# Altium schematic sheet PhaseShifter.SchDoc: Top Level
size 431 x 279 mm; Author: Kevin Heyer; DrawnBy: Kevin Heyer; Organization: ORGANIZATION; Address1: 207; Address2: 13399 104 Ave; Address3: Surrey BC, V3T 0C9; Address4: Canada; Revision: V0.0.0; SheetNumber: 1; SheetTotal: 2; Project: IQ Demod; ENG_APP_DATE: --/--/--; DSN_APP_DATE: --/--/--; CHK_APP_DATE: --/--/--
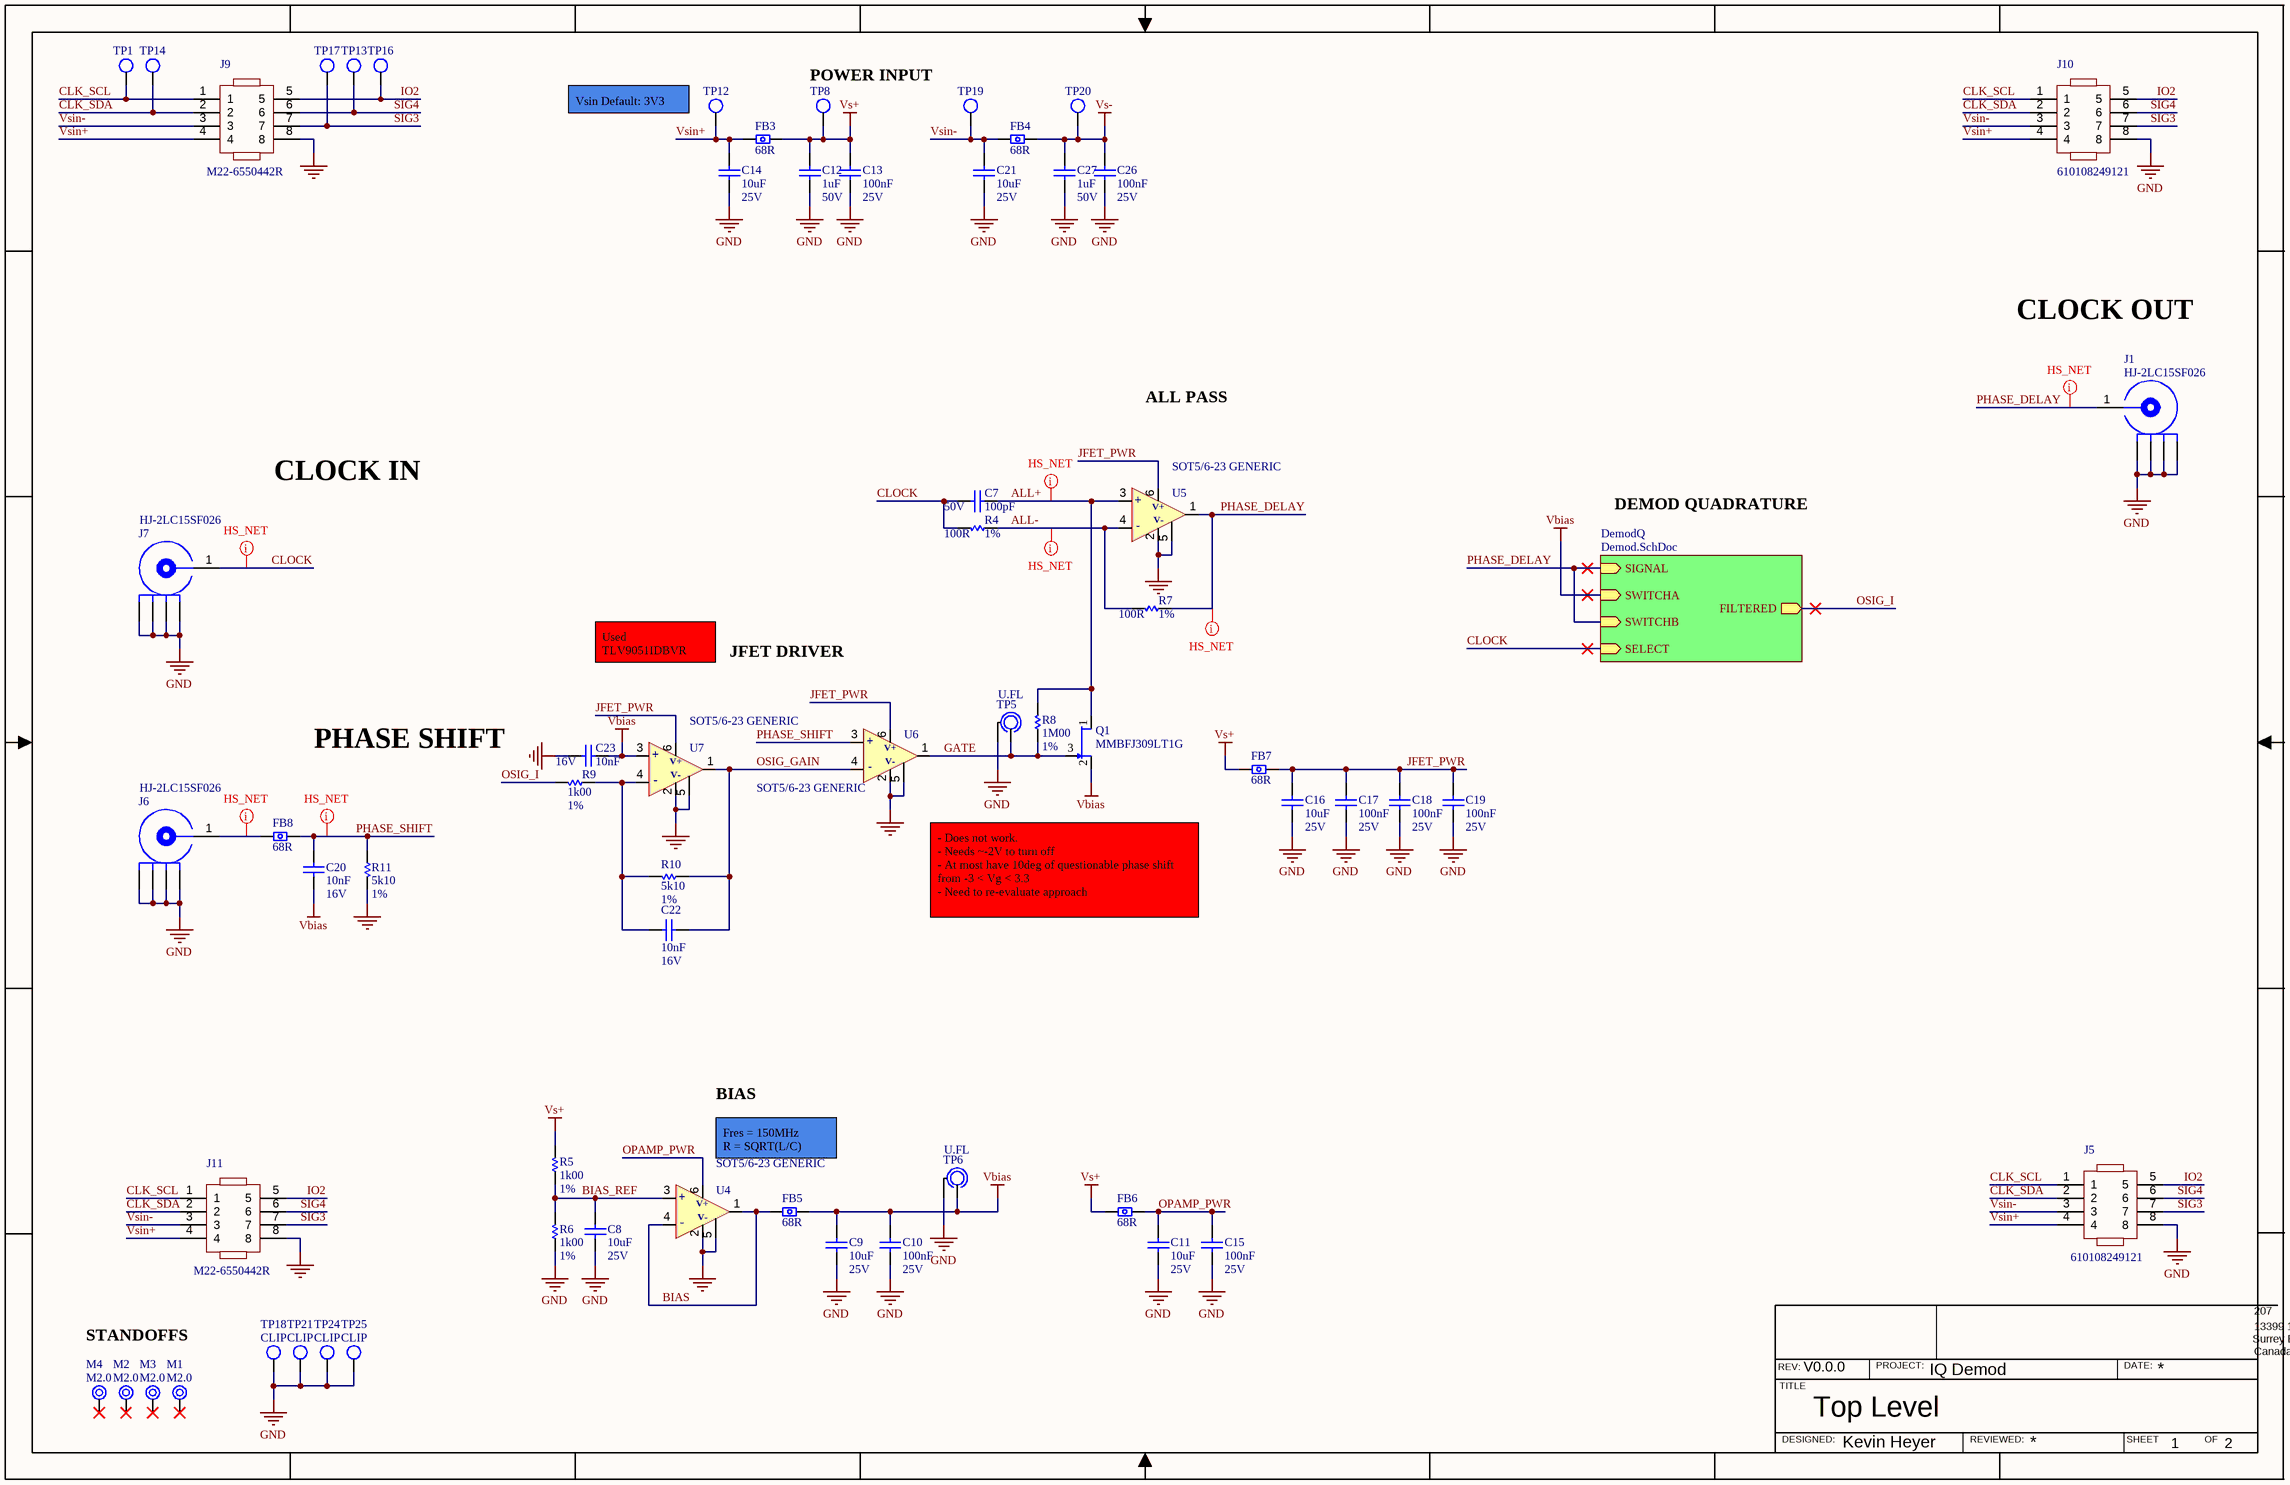
[diagram p0: PhaseShifter.SchDoc]

## Parts
C7  100pF  Voltage Rating (DC): 50V  [C0402]
C8  10uF  Voltage Rating: 25V  [c0805]
C9  10uF  Voltage Rating: 25V  [c0805]
C10  100nF  Voltage Rating: 25V  [C0402]
C11  10uF  Voltage Rating: 25V  [c0805]
C12  1uF  Voltage Rating: 50V  [c0603]
C13  100nF  Voltage Rating: 25V  [C0402]
C14  10uF  Voltage Rating: 25V  [c0805]
C15  100nF  Voltage Rating: 25V  [C0402]
C16  10uF  Voltage Rating: 25V  [c0805]
C17  100nF  Voltage Rating: 25V  [C0402]
C18  100nF  Voltage Rating: 25V  [C0402]
C19  100nF  Voltage Rating: 25V  [C0402]
C20  10nF  Voltage Rating: 16V  [c0402]
C21  10uF  Voltage Rating: 25V  [c0805]
C22  10nF  Voltage Rating: 16V  [c0402]
C23  10nF  Voltage Rating: 16V  [c0402]
C26  100nF  Voltage Rating: 25V  [C0402]
C27  1uF  Voltage Rating: 50V  [c0603]
FB3  68R  [FB0402]
FB4  68R  [FB0402]
FB5  68R  [FB0402]
FB6  68R  [FB0402]
FB7  68R  [FB0402]
FB8  68R  [FB0402]
J1  HJ-2LC15SF026  [SMA TH BORE]
J5  610108249121  [CONN HDR 08 MALE RA 2ROW - duplicate]
J6  HJ-2LC15SF026  [SMA TH BORE]
J7  HJ-2LC15SF026  [SMA TH BORE]
J9  M22-6550442R  [CONN HDR 08 FEMALE RA 2ROW]
J10  610108249121  [CONN HDR 08 MALE RA 2ROW - duplicate]
J11  M22-6550442R  [CONN HDR 08 FEMALE RA 2ROW]
M1  M2.0  [MECH M2.0 UNPLATED]  (no BOM)
M2  M2.0  [MECH M2.0 UNPLATED]  (no BOM)
M3  M2.0  [MECH M2.0 UNPLATED]  (no BOM)
M4  M2.0  [MECH M2.0 UNPLATED]  (no BOM)
Q1  MMBFJ309LT1G  [SOT 23-3]
R4  100R  Tolerance: 1%  [R0402]
R5  1k00  Tolerance: 1%  [R0402]
R6  1k00  Tolerance: 1%  [R0402]
R7  100R  Tolerance: 1%  [R0402]
R8  1M00  Tolerance: 1%  [r0402]
R9  1k00  Tolerance: 1%  [R0402]
R10  5k10  Tolerance: 1%  [R0402]
R11  5k10  Tolerance: 1%  [R0402]
TP1  1mm  [TESTPOINT_SMT]  (value not drawn)  (no BOM)
TP5  U.FL  [U.FL]
TP6  U.FL  [U.FL]
TP8  1mm  [TESTPOINT_SMT]  (value not drawn)  (no BOM)
TP12  1mm  [TESTPOINT_SMT]  (value not drawn)  (no BOM)
TP13  1mm  [TESTPOINT_SMT]  (value not drawn)  (no BOM)
TP14  1mm  [TESTPOINT_SMT]  (value not drawn)  (no BOM)
TP16  1mm  [TESTPOINT_SMT]  (value not drawn)  (no BOM)
TP17  1mm  [TESTPOINT_SMT]  (value not drawn)  (no BOM)
TP18  CLIP  [TESTPOINT_CLIP_1206]
TP19  1mm  [TESTPOINT_SMT]  (value not drawn)  (no BOM)
TP20  1mm  [TESTPOINT_SMT]  (value not drawn)  (no BOM)
TP21  CLIP  [TESTPOINT_CLIP_1206]
TP24  CLIP  [TESTPOINT_CLIP_1206]
TP25  CLIP  [TESTPOINT_CLIP_1206]
U4  SOT5/6-23 GENERIC  [SOT23-5/6_Modified]
U5  SOT5/6-23 GENERIC  [SOT23-5/6_Modified]
U6  SOT5/6-23 GENERIC  [SOT23-5/6_Modified]
U7  SOT5/6-23 GENERIC  [SOT23-5/6_Modified]

## Sub-sheets
DemodQ = Demod.SchDoc: SIGNAL (in), SWITCHA (in), SWITCHB (in), FILTERED (out), SELECT (in)

## Nets
GND: C8.1 C9.1 C10.2 C11.1 C12.1 C13.1 C14.1 C15.2 C16.1 C17.2 C18.2 C19.2 C21.1 C23.1 C26.1 C27.1 J1.0 J5.8 J6.0 J7.0 J9.8 J10.8 J11.8 R6.1 R11.2 TP5.0 TP6.0 TP18.1 TP21.1 TP24.1 TP25.1 U4.2(V-) U4.5 U5.2(V-) U5.5 U6.2(V-) U6.5 U7.2(V-) U7.5
Vbias: C9.2 C10.1 C20.2 C23.2 FB5.1 Q1.2(S) TP6.1 U7.3(+) ; sheet DemodQ/SWITCHA
Vs+: C12.2 C13.2 FB3.1 FB6.2 FB7.2 R5.2 TP8.1
Vs-: C26.2 C27.2 FB4.1 TP20.1
ALL+: C7.1 Q1.1(D) R8.2 U5.3(+)
ALL-: R4.1 R7.2 U5.4(-)
BIAS: FB5.2 U4.1 U4.4(-)
BIAS_REF: C8.2 R5.1 R6.2 U4.3(+)
CLK_SCL: J5.1 J9.1 J10.1 J11.1 TP1.1
CLK_SDA: J5.2 J9.2 J10.2 J11.2 TP14.1
CLOCK: C7.2 J7.1 R4.2 ; sheet DemodQ/SELECT
GATE: Q1.3(G) R8.1 TP5.1 U6.1
IO2: J5.5 J9.5 J10.5 J11.5 TP16.1
JFET_PWR: C16.2 C17.1 C18.1 C19.1 FB7.1 U5.6(V+) U6.6(V+) U7.6(V+)
OPAMP_PWR: C11.2 C15.1 FB6.1 U4.6(V+)
OSIG_GAIN: C22.1 R10.1 U6.4(-) U7.1
OSIG_I: R9.2 ; sheet DemodQ/FILTERED
PHASE_DELAY: J1.1 R7.1 U5.1 ; sheet DemodQ/SIGNAL, sheet DemodQ/SWITCHB
PHASE_SHIFT: C20.1 FB8.1 R11.1 U6.3(+)
SIG3: J5.7 J9.7 J10.7 J11.7 TP17.1
SIG4: J5.6 J9.6 J10.6 J11.6 TP13.1
Vsin+: C14.2 FB3.2 J5.4 J9.4 J10.4 J11.4 TP12.1
Vsin-: C21.2 FB4.2 J5.3 J9.3 J10.3 J11.3 TP19.1
NetC22_2: C22.2 R9.1 R10.2 U7.4(-)
NetFB8_2: FB8.2 J6.1

Not connected (* = marked no-connect by the designer): M1 1*; M2 1*; M3 1*; M4 1*

## Layout directives
net class HS_NET; rule Clearance Constraint [Generic clearance = 10mil, and 30 value(s) for objects]; rule Impedance Constraint [Min = 42.50    Max = 57.50    ]: ALL+, ALL-, CLOCK, NetFB8_2, PHASE_DELAY, PHASE_SHIFT

## Notes on the sheet
- (near TP8) POWER INPUT
- (near TP12) Vsin Default: 3V3
- CLOCK OUT
- ALL PASS
- CLOCK IN
- DEMOD QUADRATURE
- Used TLV9051IDBVR
- JFET DRIVER
- PHASE SHIFT
- - Does not work.
  - Needs ~-2V to turn off
  - At most have 10deg of questionable phase shift from -3 < Vg < 3.3
  - Need to re-evaluate approach
- BIAS
- Fres = 150MHz
  R = SQRT(L/C)
- STANDOFFS
- REV:
- PROJECT:
- DATE:
- TITLE
- SHEET
- OF
- DESIGNED:
- REVIEWED:

## Library data of the parts
C7 = CAP CER 100pF 50V C0G 0402: 0402 100 pF 50 V ±5% Tolerance NP0/C0G Multilayer Ceramic Chip Capacitor; Manufacturer: Yageo; Manufacturer Part Number: CC0402JPNPO9BN101; Dielectric: C0G; Supplier 1: Digi-Key; RoHS: Yes; Category: Ceramic Capacitors; Stock 1: 83787; Pricing 1: 1=0.10000, 10=0.01900, 50=0.01040, 100=0.00850, 500=0.00604, 1000=0.00475, 2500=0.00432, 5000=0.00397 (USD); Case/Package: 0402; Case Code (Imperial): 0402; Case Code (Metric): 1005; Weight: 2.3E-05oz; Min Operating Temperature: -55°C; Max Operating Temperature: 125°C; Tolerance: 5%; Packaging: Tape and Reel; Capacitance: 100pF; Termination: SMD/SMT; Resistor Type: Ceramic; Length: 1mm; Width: 0.5mm; Depth: 0.5mm; RoHS Compliant: Yes; ComponentLink1URL: http://www.mouser.com/ds/2/447/Yageo_UPY-GP_NP0_16V-to-50V_9-358835.pdf?src-supplier=Mouser; ComponentLink1Description: http://www.mouser.com/ds/2/447/Yageo_UPY-GP_NP0_16V-to-50V_9-358835.pdf?src-supplier=Mouser; ComponentLink2URL: http://components.arrow.com/part/dataview/0323_04038301?src-supplier=Arrow+Europe; ComponentLink2Description: http://components.arrow.com/part/dataview/0323_04038301?src-supplier=Arrow+Europe; Supplier Part Number 1: 13-CC0402JPNPO9BN101CT-ND
C8 C9 C11 C14 C16 C21 = CAP CER 10uF 25V X5R 0805: Cap Ceramic 10uF 25V X5R 10% SMD 0805 85°C Embossed T/R; Manufacturer: Samsung; Manufacturer Part Number: CL21A106KAYNNNE; Supplier 1: Digi-Key; RoHS: Yes; Category: Ceramic Capacitors; Stock 1: 2266338; Pricing 1: 2000=0.03549, 4000=0.03247 (USD); Mount: Surface Mount; Case/Package: 0805; Case Code (Metric): 2012; Case Code (Imperial): 0805; Min Operating Temperature: -55°C; Max Operating Temperature: 85°C; Package Quantity: 1; Packaging: Tape and Reel; Capacitance: 10uF; Tolerance: 10%; Dielectric: X5R; Series: CL; Construction: Flat; Length: 2mm; Width: 0.049inch; Height: 1.25mm; Depth: 1.25mm; Thickness: 0.057inch; Radiation Hardening: No; RoHS Compliant: Yes; ComponentLink1URL: https://datasheet.ciiva.com/25796/cl21a106kaynnne-25796720.pdf?src-supplier=Digi-Key; ComponentLink1Description: https://datasheet.ciiva.com/25796/cl21a106kaynnne-25796720.pdf?src-supplier=Digi-Key; ComponentLink2URL: https://datasheet.ciiva.com/26838/getdatasheetpartid-357558-26838583.pdf?src-supplier=Verical; ComponentLink2Description: https://datasheet.ciiva.com/26838/getdatasheetpartid-357558-26838583.pdf?src-supplier=Verical; Supplier Part Number 1: 1276-2891-2-ND
C10 C13 C15 C17-C19 C26 = CAP CER 100nF 25V X5R 0402: Cap Ceramic 0.1uF 25V X5R 10% Pad SMD 0402 85¡ãC T/R / Multi Layer Ceramic Capacitor (MLCC); Manufacturer: Samsung; Manufacturer Part Number: CL05A104KA5NNNC; Supplier 1: Digi-Key; RoHS: Yes; Category: Ceramic Capacitors; Stock 1: 8053194; Pricing 1: 1=0.10000, 10=0.01100, 50=0.00600, 100=0.00490, 500=0.00346, 1000=0.00272, 2500=0.00248, 5000=0.00228 (USD); Mount: Surface Mount; Case/Package: 0402; Case Code (Metric): 1005; Case Code (Imperial): 0402; Min Operating Temperature: -55°C; Max Operating Temperature: 85°C; Capacitance: 100nF; Tolerance: 10%; Dielectric: X5R; Packaging: Tape and Reel; Package Quantity: 1; Voltage: 25V; Series: CL; Construction: Flat; Voltage Rating (DC): 25V; Length: 1mm; Width: 0.02inch; Height: 0.5mm; Thickness: 0.022inch; Depth: 0.5mm; Radiation Hardening: No; Lead Free: Lead Free; ComponentLink1URL: https://datasheet.ciiva.com/25802/cl05a104ka5nnnc-25802704.pdf?src-supplier=Digi-Key; ComponentLink1Description: https://datasheet.ciiva.com/25802/cl05a104ka5nnnc-25802704.pdf?src-supplier=Digi-Key; ComponentLink2URL: https://datasheet.ciiva.com/26838/getdatasheetpartid-357412-26838142.pdf?src-supplier=Verical; ComponentLink2Description: https://datasheet.ciiva.com/26838/getdatasheetpartid-357412-26838142.pdf?src-supplier=Verical; ComponentLink3URL: https://datasheet.ciiva.com/16437/cl05a104ka5nnnc-16437369.pdf?src-supplier=Future+Electronics; ComponentLink3Description: https://datasheet.ciiva.com/16437/cl05a104ka5nnnc-16437369.pdf?src-supplier=Future+Electronics; ComponentLink4URL: https://datasheet.ciiva.com/26309/mlcc-catalogdownload2013-eng-26309014.pdf?src-supplier=Distrelec; ComponentLink4Description: https://datasheet.ciiva.com/26309/mlcc-catalogdownload2013-eng-26309014.pdf?src-supplier=Distrelec; Supplier Part Number 1: 1276-1043-1-ND
C12 C27 = CAP CER 1uF 50V X5R 0603: Multilayer Ceramic Capacitors (High dielectric type), 50V, 1 uF, ± 10 %, 0603, X5R, RoHS; Manufacturer: Taiyo Yuden; Manufacturer Part Number: UMK107BJ105KA-T; Tolerance: 10%; Supplier 1: Digi-Key; RoHS: Yes; Category: Ceramic Capacitors; Stock 1: 955108; Pricing 1: 1=0.19000, 10=0.12900, 50=0.07760, 100=0.06560, 500=0.04484, 1000=0.03968 (USD); Mount: Surface Mount; Case/Package: 0603; Number of Pins: 2; Case Code (Metric): 1608; Case Code (Imperial): 0603; Contact Plating: Nickel; Min Operating Temperature: -55°C; Max Operating Temperature: 85°C; Capacitance: 1uF; Packaging: Tape and Reel; Package Quantity: 1; Dielectric: X5R; Voltage Rating (DC): 50V; Termination: SMD/SMT; Series: M; Construction: Flat; Length: 1.6mm; Width: 0.031inch; Height: 0.8mm; Depth: 0.8mm; Thickness: 0.035inch; Radiation Hardening: No; RoHS Compliant: Yes; REACH SVHC: Unknown; Halogen Free: Halogen Free; ComponentLink1URL: https://datasheet.ciiva.com/134/umk107bj105ka-t-ss-134740.pdf?src-supplier=Digi-Key; ComponentLink1Description: https://datasheet.ciiva.com/134/umk107bj105ka-t-ss-134740.pdf?src-supplier=Digi-Key; ComponentLink2URL: https://datasheet.ciiva.com/11601/umk107bj105ka-t-ss-11601811.pdf?src-supplier=Avnet; ComponentLink2Description: https://datasheet.ciiva.com/11601/umk107bj105ka-t-ss-11601811.pdf?src-supplier=Avnet; ComponentLink3URL: https://datasheet.ciiva.com/5744/1697715-5744913.pdf?src-supplier=Farnell; ComponentLink3Description: https://datasheet.ciiva.com/5744/1697715-5744913.pdf?src-supplier=Farnell; ComponentLink4URL: https://datasheet.ciiva.com/30199/43umk107bj105ka-t-30199791.pdf?src-supplier=Onlinecomponents.com; ComponentLink4Description: https://datasheet.ciiva.com/30199/43umk107bj105ka-t-30199791.pdf?src-supplier=Onlinecomponents.com; ComponentLink5URL: https://datasheet.ciiva.com/15922/336umk107bj105ka-t-15922611.pdf?src-supplier=Onlinecomponents.com; ComponentLink5Description: https://datasheet.ciiva.com/15922/336umk107bj105ka-t-15922611.pdf?src-supplier=Onlinecomponents.com; ComponentLink6URL: https://datasheet.ciiva.com/5427/mlcc-all-e-541559-5427036.pdf?src-supplier=Mouser; ComponentLink6Description: https://datasheet.ciiva.com/5427/mlcc-all-e-541559-5427036.pdf?src-supplier=Mouser; ComponentLink7URL: https://datasheet.ciiva.com/7975/mlcc-all-e-7975898.pdf?src-supplier=Element14; ComponentLink7Description: https://datasheet.ciiva.com/7975/mlcc-all-e-7975898.pdf?src-supplier=Element14; ComponentLink8URL: https://datasheet.ciiva.com/7975/1697715-7975608.pdf?src-supplier=Element14; ComponentLink8Description: https://datasheet.ciiva.com/7975/1697715-7975608.pdf?src-supplier=Element14; ComponentLink9URL: https://datasheet.ciiva.com/22694/1697715-22694278.pdf?src-supplier=Element14; ComponentLink9Description: https://datasheet.ciiva.com/22694/1697715-22694278.pdf?src-supplier=Element14; Supplier Part Number 1: 587-2400-1-ND
C20 C22 C23 = CAP CER 10nF 16V Y5V 0402: 0402 10 nF 16 V -20 / +80 % Tolerance Y5V SMT Multilayer Ceramic Capacitor; Manufacturer: Yageo; Manufacturer Part Number: CC0402ZRY5V7BB103; Tolerance: 80%; Insulation Resistance: 100GR; Supplier 1: Future Electronics; RoHS: Yes; Category: Ceramic Capacitors; Stock 1: 10000; Pricing 1: 10000=0.00340, 30000=0.00320, 100000=0.00300, 200000=0.00290, 400000=0.00270 (USD); Mount: Surface Mount; Case/Package: 0402; Number of Pins: 2; Case Code (Imperial): 0402; Case Code (Metric): 1005; Dielectric Material: Ceramic; Min Operating Temperature: -55°C; Max Operating Temperature: 85°C; Capacitance: 10nF; Packaging: Tape and Reel; Voltage Rating (DC): 16V; Dielectric: Y5V; Termination: SMD/SMT; Series: CC; Package Quantity: 10000; Construction: Flat; Length: 1mm; Width: 0.02inch; Height: 0.5mm; Depth: 0.5mm; Thickness: 0.022inch; Terminal Length: 0.225mm; Radiation Hardening: No; RoHS Compliant: Yes; Lead Free: Lead Free; REACH SVHC: No SVHC; Halogen Free: Halogen Free; ComponentLink1URL: https://datasheet.ciiva.com/144/mlccorderingcode-144484.pdf?src-supplier=Digi-Key; ComponentLink1Description: https://datasheet.ciiva.com/144/mlccorderingcode-144484.pdf?src-supplier=Digi-Key; ComponentLink2URL: https://datasheet.ciiva.com/144/mlccorderingcode-144485.pdf?src-supplier=Digi-Key; ComponentLink2Description: https://datasheet.ciiva.com/144/mlccorderingcode-144485.pdf?src-supplier=Digi-Key; ComponentLink3URL: https://datasheet.ciiva.com/144/mlccorderingcode-144486.pdf?src-supplier=Digi-Key; ComponentLink3Description: https://datasheet.ciiva.com/144/mlccorderingcode-144486.pdf?src-supplier=Digi-Key; ComponentLink4URL: https://datasheet.ciiva.com/11586/upy-gphc-y5v-6-3v-to-50v-5-11586517.pdf?src-supplier=Avnet; ComponentLink4Description: https://datasheet.ciiva.com/11586/upy-gphc-y5v-6-3v-to-50v-5-11586517.pdf?src-supplier=Avnet; ComponentLink5URL: https://datasheet.ciiva.com/5789/1132289-5789565.pdf?src-supplier=Farnell; ComponentLink5Description: https://datasheet.ciiva.com/5789/1132289-5789565.pdf?src-supplier=Farnell; ComponentLink6URL: https://datasheet.ciiva.com/5789/1132289-5789566.pdf?src-supplier=Farnell; ComponentLink6Description: https://datasheet.ciiva.com/5789/1132289-5789566.pdf?src-supplier=Farnell; ComponentLink7URL: https://datasheet.ciiva.com/17437/upy-gphc-y5v-6-3v-to-50v-5-17437221.pdf?src-supplier=Avnet+Europe; ComponentLink7Description: https://datasheet.ciiva.com/17437/upy-gphc-y5v-6-3v-to-50v-5-17437221.pdf?src-supplier=Avnet+Europe; ComponentLink8URL: https://datasheet.ciiva.com/8033/1132289-8033641.pdf?src-supplier=Element14; ComponentLink8Description: https://datasheet.ciiva.com/8033/1132289-8033641.pdf?src-supplier=Element14; ComponentLink9URL: https://datasheet.ciiva.com/8033/1132289-8033642.pdf?src-supplier=Element14; ComponentLink9Description: https://datasheet.ciiva.com/8033/1132289-8033642.pdf?src-supplier=Element14; Supplier Part Number 1: 1300987
FB3-FB8 = FB 68R 400mA 310mR 0402: Ferrite Beads Multi-Layer 68Ohm 25% 100MHz 400mA 310mOhm DCR 0402 T/R; Manufacturer: Taiyo Yuden; Manufacturer Part Number: BK1005LL680-T; DC Resistance (DCR): 310mR; Number of Lines: 1; Shielding: Unshielded; Supplier 1: Digi-Key; RoHS: Yes; Category: Ferrite Beads and Chips; Stock 1: 9707; Pricing 1: 1=0.10000, 10=0.04100, 25=0.03640, 50=0.03300, 100=0.02970, 250=0.02176, 500=0.01584, 1000=0.01551, 5000=0.01056 (USD); Mount: Surface Mount; Case/Package: 0402; Number of Pins: 2; Case Code (Metric): 1005; Case Code (Imperial): 0402; Core Material: Ferrite; Min Operating Temperature: -55°C; Max Operating Temperature: 125°C; Packaging: Tape and Reel; Package Quantity: 1; Impedance: 68R; Tolerance: 25%; Max DC Current: 400mA; Termination: SMD/SMT; Test Frequency: 100MHz; Max Current Rating: 400mA; Series: BK; Frequency: 100MHz; Length: 0.039inch; Width: 0.02inch; Height: 0.022inch; Depth: 0.55mm; Halogen Free: Halogen Free; Lead Free: Lead Free; REACH SVHC: Unknown; ComponentLink1URL: https://datasheet.ciiva.com/1013/bk1005ll680-t-ss-1013936.pdf?src-supplier=Digi-Key; ComponentLink1Description: https://datasheet.ciiva.com/1013/bk1005ll680-t-ss-1013936.pdf?src-supplier=Digi-Key; ComponentLink2URL: https://datasheet.ciiva.com/1013/mlci07-e-1013935.pdf?src-supplier=Digi-Key; ComponentLink2Description: https://datasheet.ciiva.com/1013/mlci07-e-1013935.pdf?src-supplier=Digi-Key; ComponentLink3URL: https://datasheet.ciiva.com/1013/mlci07-e-1013937.pdf?src-supplier=Digi-Key; ComponentLink3Description: https://datasheet.ciiva.com/1013/mlci07-e-1013937.pdf?src-supplier=Digi-Key; Supplier Part Number 1: 587-1860-1-ND
J1 J6 J7 = CON SMA BORE TH HJ-SMA058
J5 J10 = CONN HDR 08 MALE RA 2 ROW: SMT Angled Pin Header WR-PHD, Pitch 2.54 mm, Dual Row, 8 pins; Manufacturer: Wurth Electronics; Number of Positions: 8; Current Rating: 3A; Gender: Male; Voltage Rating: 250V; Pitch: 0.1inch; Supplier 1: Newark; Manufacturer Part Number: 610108249121; RoHS: Yes; Category: Connectors; Stock 1: 350; Pricing 1: 1=1.53000, 10=1.52000, 25=1.49000, 50=1.46000, 100=1.36000 (USD); Mount: Surface Mount; Contact Plating: Gold; Contact Material: Copper Alloy; Insulation Color: Black; Insulation Material: Nylon; Contact Shape: Square; Connector Type: Header; Fastening Type: Pull; Packaging: Cut Tape; Number of Rows: 2; Termination: Solder; Flammability Rating: UL94 V-0; RoHS Compliant: Yes; ComponentLink1URL: http://www.farnell.com/cad/1889791.pdf?src-supplier=Element14; ComponentLink1Description: http://www.farnell.com/cad/1889791.pdf?src-supplier=Element14; Supplier Part Number 1: 72Y1215; Number of Pins: 8; Color: Black; Contact Finish - Mating: GOLD; Number of Contacts: 8; Series: WR-PHD; Contact Type: Male Pin; Row Spacing: 0.1inch; Contact Mating Length: 0.236inch; ComponentLink2URL: https://katalog.we-online.de/em/datasheet/6101xx249121.pdf?src-supplier=Digi-Key; ComponentLink2Description: https://katalog.we-online.de/em/datasheet/6101xx249121.pdf?src-supplier=Digi-Key; ComponentLink3URL: https://www.distrelec.bizhttp://katalog.we-online.de/em/datasheet/6101xx249121.pdf?mime=application%2Fpdf&src-supplier=Distrelec; ComponentLink3Description: https://www.distrelec.bizhttp://katalog.we-online.de/em/datasheet/6101xx249121.pdf?mime=application%2Fpdf&src-supplier=Distrelec
J9 J11 = CONN HDR 08 FEMALE RA 2 ROW: Conn Socket Strip RCP 8 POS 2mm Solder RA SMD T/R; Manufacturer: Harwin; Current Rating: 2A; Number of Positions: 8; Connector Type: Receptacle,Forked; Supplier 1: Newark; Manufacturer Part Number: M22-6550442R; RoHS: Yes; Category: Connectors; Stock 1: 750; Pricing 1: 1=1.17000, 100=0.91900, 250=0.84000, 500=0.76600, 1000=0.71200 (USD); Mount: Surface Mount; Contact Material: Bronze; Contact Plating: Gold; Contact Shape: Square; Insulation Material: Polymer; Insulation Color: Black; Packaging: Cut Tape; Number of Rows: 2; Termination: Solder; Fastening Type: Push,Pull; RoHS Compliant: Yes; Flammability Rating: UL94 V-0; ComponentLink1URL: https://cdn.harwin.com/pdfs/M22-655R.pdf?src-supplier=Digi-Key; ComponentLink1Description: https://cdn.harwin.com/pdfs/M22-655R.pdf?src-supplier=Digi-Key; Supplier Part Number 1: 45AJ6425; Min Operating Temperature: -40°C; Max Operating Temperature: 105°C
M1-M4 = MECH M2.0 UNPLATED
Q1 = TRANS NJFET 25V SOT23-3 MMBFJ309LT1G: Transistor; JFET - VHF/UHF Amplifier; 25 VDC; 10 mADC; SOT-23 (TO-236); Pb-Free; Manufacturer 1: ON Semiconductor; Category 1: JFETs; Voltage Rating: 25V; Power Dissipation: 225mW; Input Capacitance: 5pF; Voltage Rating (DC): -25V; Continuous Drain Current (ID): 10mA; Polarity: N-CHANNEL; Polarization: N; Supplier 1: Future Electronics; Supplier Part Number 1: 4084901; Manufacturer Part Number 1: MMBFJ309LT1G; RoHS 1: Yes; Description 1: Transistor; JFET - VHF/UHF Amplifier; 25 VDC; 10 mADC; SOT-23 (TO-236); Pb-Free; Stock 1: 12000; Pricing 1: 3000=0.0952, 9000=0.0915, 12000=0.0905, 30000=0.0876, 45000=0.0847 (USD); Case/Package: SOT-23-3; Pins: 3; Weight: 0.050717oz; Min Operating Temperature: -55°C; Max Operating Temperature: 150°C; Packaging: Tape and Reel; Gate to Source Voltage (Vgs): 25V; Series: -; Package Quantity: 3000; Drain to Source Voltage (Vdss): 25V; Breakdown Voltage: -25V; Length: 0.119inch; Width: 0.055inch; Height: 0.04inch; Radiation Hardening: No; Lead Free: Lead Free; RoHS Compliant: Yes; Reach SVHC Compliant: No; Halogen Free: Halogen Free; ComponentLink1URL: https://datasheet.ciiva.com/1187/mmbfj309lt1-d-1187696.pdf?src-supplier=Element14; ComponentLink1Description: https://datasheet.ciiva.com/1187/mmbfj309lt1-d-1187696.pdf?src-supplier=Element14; ComponentLink2URL: https://datasheet.ciiva.com/6362/mmbfj309lt1-d-6362849.pdf?src-supplier=Digi-Key; ComponentLink2Description: https://datasheet.ciiva.com/6362/mmbfj309lt1-d-6362849.pdf?src-supplier=Digi-Key; ComponentLink3URL: https://datasheet.ciiva.com/30480/0900766b811a6593-30480155.pdf?src-supplier=Rs; ComponentLink3Description: https://datasheet.ciiva.com/30480/0900766b811a6593-30480155.pdf?src-supplier=Rs; ComponentLink4URL: https://datasheet.ciiva.com/8084/mmbfj309lt1-d-8084199.pdf?src-supplier=Avnet; ComponentLink4Description: https://datasheet.ciiva.com/8084/mmbfj309lt1-d-8084199.pdf?src-supplier=Avnet; ComponentLink5URL: https://datasheet.ciiva.com/16376/mmbfj309lt1-d-16376405.pdf?src-supplier=Future+Electronics; ComponentLink5Description: https://datasheet.ciiva.com/16376/mmbfj309lt1-d-16376405.pdf?src-supplier=Future+Electronics; ComponentLink6URL: https://datasheet.ciiva.com/6362/mmbfj309lt1-d-6362854.pdf?src-supplier=Digi-Key; ComponentLink6Description: https://datasheet.ciiva.com/6362/mmbfj309lt1-d-6362854.pdf?src-supplier=Digi-Key; ComponentLink7URL: https://datasheet.ciiva.com/1187/mmbfj309lt1-d-1187695.pdf?src-supplier=Element14; ComponentLink7Description: https://datasheet.ciiva.com/1187/mmbfj309lt1-d-1187695.pdf?src-supplier=Element14
R4 R7 = RES 100R 63mW 1% 0402: Res General Purpose Thick Film 0402 100 Ohm 1% 1/16W ±100ppm/°C Molded SMD Paper T/R; Manufacturer: Yageo; Manufacturer Part Number: RC0402FR-07100RL; Power Rating: 62.5mW; Voltage Rating: 50V; Max Power Dissipation: 63mW; Supplier 1: Newark; RoHS: Yes; Category: Chip SMD Resistors; Stock 1: 4390000; Pricing 1: 1=0.00100, 10000=0.00100 (USD); Case/Package: 0402; Number of Pins: 2; Case Code (Imperial): 0402; Case Code (Metric): 1005; Size Code: 0402; Min Operating Temperature: -55°C; Max Operating Temperature: 155°C; Voltage Rating (DC): 50V; Resistance: 100R; Packaging: Tape and Reel; Termination: SMD/SMT; Resistor Type: Thick Film; Temperature Coefficient: 100ppm/°C; Features: Moisture Resistant; Series: RC; Number of Terminations: 2; Resistance Tolerance: 1%; Construction: Rectangular; Technology: THICK FILM; Length: 1mm; Width: 0.5mm; Height: 0.32mm; Depth: 0.5mm; RoHS Compliant: Yes; Reach SVHC Compliant: Yes; Military Standard: Not; Lead Free: Lead Free; ComponentLink1URL: https://datasheet.ciiva.com/11808/0900766b80c66297-11808765.pdf?src-supplier=RSComponents; ComponentLink1Description: https://datasheet.ciiva.com/11808/0900766b80c66297-11808765.pdf?src-supplier=RSComponents; ComponentLink2URL: https://datasheet.ciiva.com/7849/1784430-7849810.pdf?src-supplier=Element14; ComponentLink2Description: https://datasheet.ciiva.com/7849/1784430-7849810.pdf?src-supplier=Element14; ComponentLink3URL: https://datasheet.ciiva.com/28367/1018594-28367226.pdf?src-supplier=Element14; ComponentLink3Description: https://datasheet.ciiva.com/28367/1018594-28367226.pdf?src-supplier=Element14; ComponentLink4URL: https://datasheet.ciiva.com/22747/1018594-22747511.pdf?src-supplier=Element14; ComponentLink4Description: https://datasheet.ciiva.com/22747/1018594-22747511.pdf?src-supplier=Element14; ComponentLink5URL: https://datasheet.ciiva.com/12667/pyu-rc0402-51-rohs-l-6-r-12667957.pdf?src-supplier=Mouser; ComponentLink5Description: https://datasheet.ciiva.com/12667/pyu-rc0402-51-rohs-l-6-r-12667957.pdf?src-supplier=Mouser; ComponentLink6URL: https://datasheet.ciiva.com/15189/getdatasheetpartid-329466-15189335.pdf?src-supplier=Verical; ComponentLink6Description: https://datasheet.ciiva.com/15189/getdatasheetpartid-329466-15189335.pdf?src-supplier=Verical; ComponentLink7URL: https://datasheet.ciiva.com/16740/pyu-rc0402-51-rohs-l-6-r-16740566.pdf?src-supplier=Future+Electronics; ComponentLink7Description: https://datasheet.ciiva.com/16740/pyu-rc0402-51-rohs-l-6-r-16740566.pdf?src-supplier=Future+Electronics; Supplier Part Number 1: 45Y6897
R5 R6 R9 = RES 1k00 63mW 0402: 1 kOhms ¡À1% 0.063W, 1/16W Chip Resistor 0402 (1005 Metric) Moisture Resistant Thick Film; Manufacturer: Yageo; Manufacturer Part Number: RC0402FR-071KL; Resistance: 1kR; Temperature Coefficient: 100ppm/°C; Power Rating: 62.5mW; Voltage Rating: 50V; Max Power Dissipation: 63mW; Supplier 1: Newark; RoHS: Yes; Category: Chip SMD Resistors; Stock 1: 3520000; Pricing 1: 1=0.00100, 10000=0.00100 (USD); Case/Package: 0402; Number of Pins: 2; Case Code (Imperial): 0402; Case Code (Metric): 1005; Size Code: 0402; Min Operating Temperature: -55°C; Max Operating Temperature: 155°C; Resistor Type: Thick Film; Packaging: Tape and Reel; Voltage Rating (DC): 50V; Termination: SMD/SMT; Features: Moisture Resistant; Series: RC; Number of Terminations: 2; Resistance Tolerance: 1%; Construction: Rectangular; Technology: THICK FILM; Length: 1mm; Width: 0.5mm; Height: 0.32mm; Depth: 0.5mm; RoHS Compliant: Yes; Reach SVHC Compliant: Yes; Military Standard: Not; Lead Free: Lead Free; ComponentLink1URL: https://datasheet.ciiva.com/11819/0900766b80c66297-11819477.pdf?src-supplier=RSComponents; ComponentLink1Description: https://datasheet.ciiva.com/11819/0900766b80c66297-11819477.pdf?src-supplier=RSComponents; ComponentLink2URL: https://datasheet.ciiva.com/7983/1018594-7983502.pdf?src-supplier=Element14; ComponentLink2Description: https://datasheet.ciiva.com/7983/1018594-7983502.pdf?src-supplier=Element14; ComponentLink3URL: https://datasheet.ciiva.com/22747/1018594-22747513.pdf?src-supplier=Element14; ComponentLink3Description: https://datasheet.ciiva.com/22747/1018594-22747513.pdf?src-supplier=Element14; ComponentLink4URL: https://datasheet.ciiva.com/12666/pyu-rc0402-51-rohs-l-6-r-12666741.pdf?src-supplier=Mouser; ComponentLink4Description: https://datasheet.ciiva.com/12666/pyu-rc0402-51-rohs-l-6-r-12666741.pdf?src-supplier=Mouser; ComponentLink5URL: https://datasheet.ciiva.com/7849/1018594-7849869.pdf?src-supplier=Element14; ComponentLink5Description: https://datasheet.ciiva.com/7849/1018594-7849869.pdf?src-supplier=Element14; ComponentLink6URL: https://datasheet.ciiva.com/7849/1018594-7849871.pdf?src-supplier=Element14; ComponentLink6Description: https://datasheet.ciiva.com/7849/1018594-7849871.pdf?src-supplier=Element14; ComponentLink7URL: https://datasheet.ciiva.com/17063/pyu-rc0402-51-rohs-l-6-r-17063193.pdf?src-supplier=Future+Electronics; ComponentLink7Description: https://datasheet.ciiva.com/17063/pyu-rc0402-51-rohs-l-6-r-17063193.pdf?src-supplier=Future+Electronics; Supplier Part Number 1: 48Y4534
R8 = RES 1M00 1% 63mW 0402: 贴片电阻 1000000Ω ± 1.00% 0.0625W ± 100ppm/℃ 0402; Manufacturer: Yageo; Manufacturer Part Number: RC0402FR-071ML; Resistance: 1MR; Power Rating: 63mW; Voltage Rating: 50V; Temperature Coefficient: 100ppm/°C; Supplier 1: RSComponents; RoHS: Yes; Category: Chip SMD Resistors; Stock 1: 110000; Pricing 1: 10000=0.00100 (USD); Case/Package: 0402; Case Code (Imperial): 0402; Case Code (Metric): 1005; Size Code: 0402; Min Operating Temperature: -55°C; Max Operating Temperature: 155°C; Resistor Type: Thick Film; Packaging: Tape and Reel; Termination: SMD/SMT; Features: Moisture Resistant; Series: RC; Max Power Dissipation: 63mW; Number of Terminations: 2; Resistance Tolerance: 1%; Construction: Rectangular; Technology: THICK FILM; Length: 1mm; Height: 0.32mm; Depth: 0.5mm; RoHS Compliant: Yes; REACH SVHC: Unknown; Military Standard: Not; Lead Free: Lead Free; ComponentLink1URL: https://datasheet.ciiva.com/11808/0900766b80c66297-11808125.pdf?src-supplier=RSComponents; ComponentLink1Description: https://datasheet.ciiva.com/11808/0900766b80c66297-11808125.pdf?src-supplier=RSComponents; ComponentLink2URL: https://datasheet.ciiva.com/46394/1018594-46394951.pdf?src-supplier=Element14; ComponentLink2Description: https://datasheet.ciiva.com/46394/1018594-46394951.pdf?src-supplier=Element14; ComponentLink3URL: https://datasheet.ciiva.com/7849/1018594-7849883.pdf?src-supplier=Element14; ComponentLink3Description: https://datasheet.ciiva.com/7849/1018594-7849883.pdf?src-supplier=Element14; ComponentLink4URL: https://datasheet.ciiva.com/7849/1018594-7849882.pdf?src-supplier=Element14; ComponentLink4Description: https://datasheet.ciiva.com/7849/1018594-7849882.pdf?src-supplier=Element14; ComponentLink5URL: https://datasheet.ciiva.com/16741/pyu-rc0402-51-rohs-l-6-r-16741081.pdf?src-supplier=Future+Electronics; ComponentLink5Description: https://datasheet.ciiva.com/16741/pyu-rc0402-51-rohs-l-6-r-16741081.pdf?src-supplier=Future+Electronics; Supplier Part Number 1: 6186194
R10 R11 = RES 5k10: 贴片电阻 5100Ω ± 1.00% 0.0625W ± 100ppm/℃ 0402; Manufacturer: Yageo; Manufacturer Part Number: RC0402FR-075K1L; Power Rating: 63mW; Resistance: 5.1kR; Temperature Coefficient: 100ppm/°C; Voltage Rating: 50V; Supplier 1: RSComponents; RoHS: Yes; Category: Chip SMD Resistors; Stock 1: 27100; Pricing 1: 10000=0.00100 (GBP); Case/Package: 0402; Case Code (Metric): 1005; Case Code (Imperial): 0402; Min Operating Temperature: -55°C; Max Operating Temperature: 155°C; Technology: THICK FILM; Packaging: Tape and Reel; Package Quantity: 1; Resistor Type: Thick Film; Number of Terminations: 2; Termination: SMD/SMT; Max Power Dissipation: 63mW; Voltage Rating (DC): 50V; Working Voltage: 50V; Features: Moisture Resistant; Series: RC; Resistance Tolerance: 1%; Construction: Rectangular; Length: 1mm; Width: 0.02inch; Height: 0.016inch; Depth: 0.5mm; RoHS Compliant: Yes; REACH SVHC: Unknown; Military Standard: Not; Lead Free: Lead Free; ComponentLink1URL: https://datasheet.ciiva.com/7983/1018594-7983519.pdf?src-supplier=Element14; ComponentLink1Description: https://datasheet.ciiva.com/7983/1018594-7983519.pdf?src-supplier=Element14; ComponentLink2URL: https://datasheet.ciiva.com/46394/1018594-46394936.pdf?src-supplier=Element14; ComponentLink2Description: https://datasheet.ciiva.com/46394/1018594-46394936.pdf?src-supplier=Element14; ComponentLink3URL: https://datasheet.ciiva.com/2453/pyu-r-int-thick-7-2453401.pdf?src-supplier=Digi-Key; ComponentLink3Description: https://datasheet.ciiva.com/2453/pyu-r-int-thick-7-2453401.pdf?src-supplier=Digi-Key; ComponentLink4URL: https://datasheet.ciiva.com/2453/pyu-r-int-thick-7-2453402.pdf?src-supplier=Digi-Key; ComponentLink4Description: https://datasheet.ciiva.com/2453/pyu-r-int-thick-7-2453402.pdf?src-supplier=Digi-Key; ComponentLink5URL: https://datasheet.ciiva.com/2453/pyu-r-int-thick-7-2453400.pdf?src-supplier=Digi-Key; ComponentLink5Description: https://datasheet.ciiva.com/2453/pyu-r-int-thick-7-2453400.pdf?src-supplier=Digi-Key; ComponentLink6URL: https://datasheet.ciiva.com/12558/pyu-rc0402-51-rohs-l-6-r-8721-12558460.pdf?src-supplier=Mouser; ComponentLink6Description: https://datasheet.ciiva.com/12558/pyu-rc0402-51-rohs-l-6-r-8721-12558460.pdf?src-supplier=Mouser; ComponentLink7URL: https://datasheet.ciiva.com/16744/pyu-rc0402-51-rohs-l-6-r-16744283.pdf?src-supplier=Future+Electronics; ComponentLink7Description: https://datasheet.ciiva.com/16744/pyu-rc0402-51-rohs-l-6-r-16744283.pdf?src-supplier=Future+Electronics; ComponentLink8URL: https://datasheet.ciiva.com/15189/getdatasheetpartid-323636-15189493.pdf?src-supplier=Verical; ComponentLink8Description: https://datasheet.ciiva.com/15189/getdatasheetpartid-323636-15189493.pdf?src-supplier=Verical; Supplier Part Number 1: 1987834
TP1 TP8 TP12-TP14 TP16 TP17 TP19 TP20 = TP 1mm: SMT testpoint
TP5 TP6 = TP U.FL: CONN U.FL RCPT STR 50 OHM SMD; Manufacturer: Hirose; Manufacturer Part Number: U.FL-R-SMT-1(80); Body Material: Bronze; Body Plating: Silver; Center Contact Plating: Gold; Dielectric Material: Polymer; Connector Type: Receptacle,Male Pin; Impedance: 50R; Max Frequency: 6GHz; Number of Ports: 1; Mating Cycles: 30; Supplier 1: Future Electronics; RoHS: Yes; Category: RF / Coaxial Connectors; Stock 1: 40000; Pricing 1: 10000=0.81500, 20000=0.80000, 30000=0.78500 (USD); Mount: Surface Mount; Case/Package: SMD/SMT; Contact Material: Brass; Housing Color: Beige; Min Operating Temperature: -40°C; Max Operating Temperature: 90°C; Package Quantity: 10000; Packaging: Tape and Reel; Fastening Type: SNAP-ON; Series: U.FL; Termination: Solder; Lead Free: Lead Free; RoHS Compliant: Yes; ComponentLink1URL: http://www.mouser.com/ds/2/185/U.FL_catalog-939761.pdf?src-supplier=Mouser; ComponentLink1Description: http://www.mouser.com/ds/2/185/U.FL_catalog-939761.pdf?src-supplier=Mouser; ComponentLink2URL: https://www.hirose.com/product/en/download_file/key_name/U.FL-R-SMT-1%2880%29/category/Specification%20Sheet/doc_file_id/37638/?file_category_id=9&item_id=03310472280&is_series=&src-supplier=Digi-Key; ComponentLink2Description: https://www.hirose.com/product/en/download_file/key_name/U.FL-R-SMT-1%2880%29/category/Specification%20Sheet/doc_file_id/37638/?file_category_id=9&item_id=03310472280&is_series=&src-supplier=Digi-Key
TP18 TP21 TP24 TP25 = TP CLIP 1206 RCWCTE: Current Sense Resistors - SMD CHIP CHECKER HT=2.0 1206; Manufacturer: KOA Speer; Manufacturer Part Number: RCWCTE; Resistance: 0R; Current Rating: 2A; Supplier 1: Digi-Key; RoHS: Yes; Category: Chip SMD Resistors; Stock 1: 282207; Pricing 1: 1=0.16000, 10=0.13700, 25=0.12120, 50=0.11320, 100=0.10500, 250=0.09292, 500=0.08888, 1000=0.07272 (USD); Mount: Surface Mount; Case/Package: 1206; Case Code (Imperial): 1206; Case Code (Metric): 3216; Min Operating Temperature: -55°C; Max Operating Temperature: 125°C; Packaging: Tape and Reel; Termination: SMD/SMT; Series: RC; Length: 3.2mm; Width: 1.6mm; Height: 2mm; Depth: 1.6mm; Military Standard: Not; RoHS Compliant: Yes; ComponentLink1URL: https://datasheet.ciiva.com/34302/1876186-34302940.pdf?src-supplier=Jameco; ComponentLink1Description: https://datasheet.ciiva.com/34302/1876186-34302940.pdf?src-supplier=Jameco; ComponentLink2URL: https://datasheet.ciiva.com/5556/rc-5556236.pdf?src-supplier=Mouser; ComponentLink2Description: https://datasheet.ciiva.com/5556/rc-5556236.pdf?src-supplier=Mouser; ComponentLink3URL: https://datasheet.ciiva.com/26821/getdatasheetpartid-110197-26821157.pdf?src-supplier=Verical; ComponentLink3Description: https://datasheet.ciiva.com/26821/getdatasheetpartid-110197-26821157.pdf?src-supplier=Verical; Supplier Part Number 1: 2019-RCWCTECT-ND
U4-U7 = IC OPAMP SOT5/6-23 GENERIC: Number of Channels: 1; RoHS: Yes; Category: Amplifiers - Op Amps, Buffer, Instrumentation; Mount: Surface Mount; Case/Package: SOT; Number of Pins: 6; Number of Circuits: 1; RoHS Compliant: Yes